# Altium project WMCB-V1_Project.PrjPCB
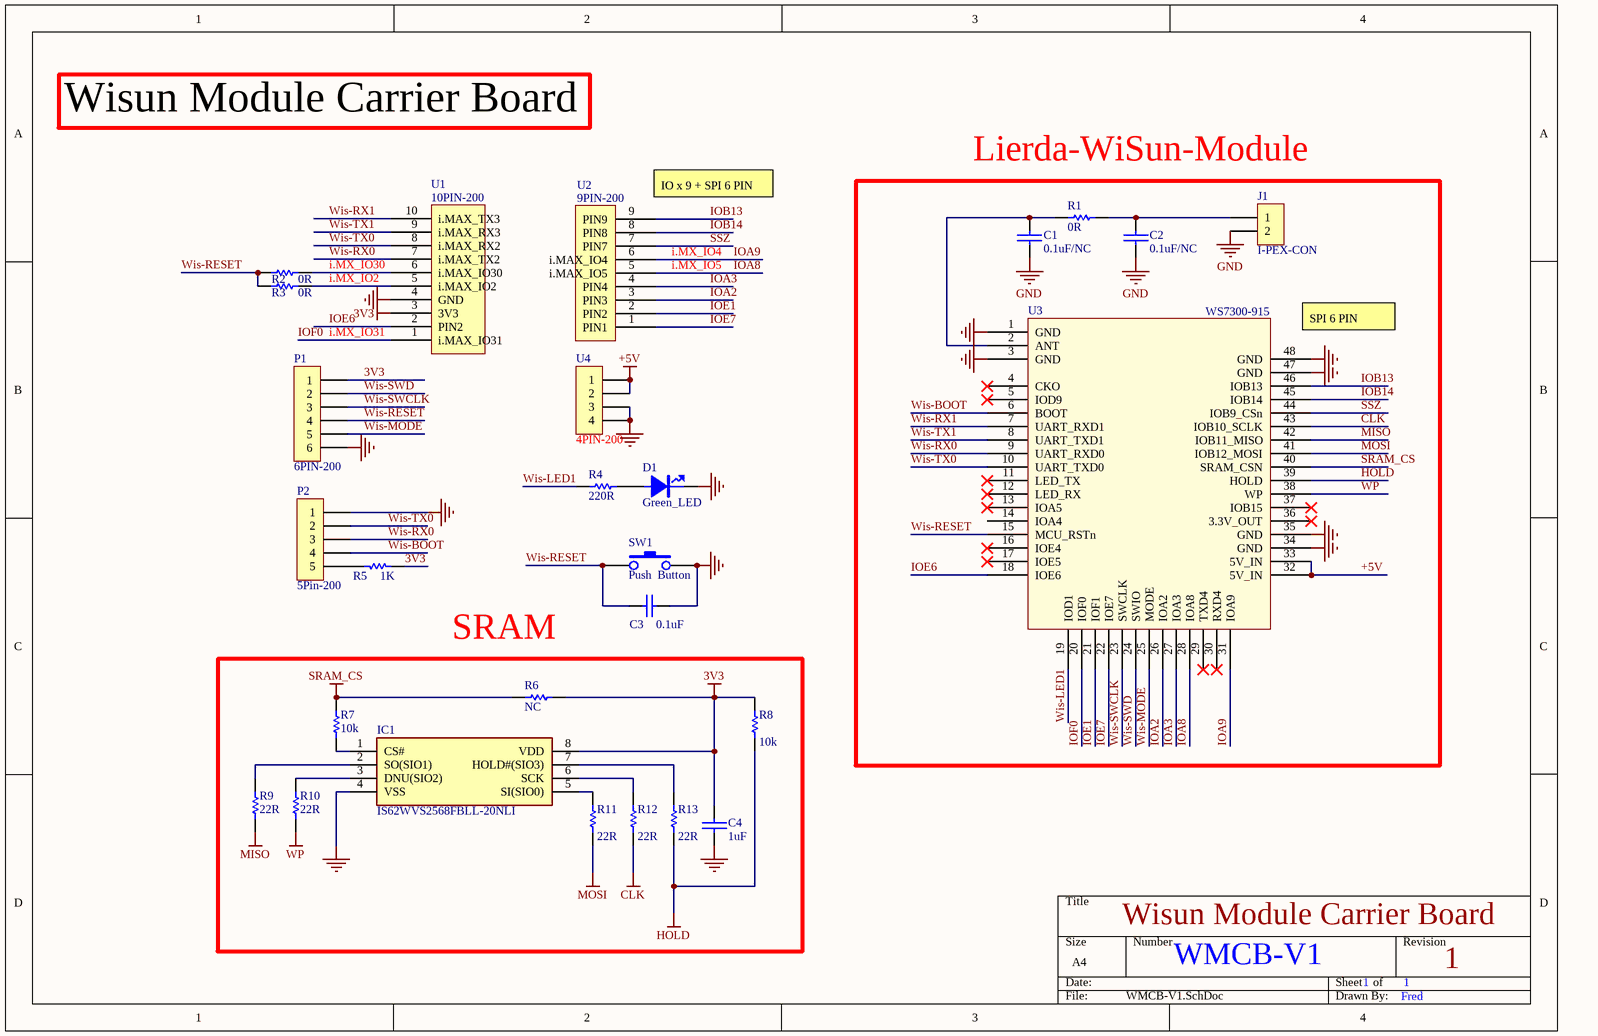
[diagram p0: WMCB-V1.SchDoc]
1 sheet, 27 parts. Net scope: global (net labels, ports and power ports of the same name join across sheets).
Board file: WMCB-V1.PcbDoc

## Sheet WMCB-V1.SchDoc
size A4

### Parts
C1  0.1uF/NC  [0402C]
C2  0.1uF/NC  [0402C]
C3  0.1uF  [0402C]
C4  1uF  [0402C]
D1  Green_LED  [LED0603--0.4mm]
IC1  IS62WVS2568FBLL-20NLI  [SOIC127P600X175-8N]
J1  I-PEX-CON  [I-PEX-CON]
P1  6PIN-200  [6PIN-200]
P2  5Pin-200  [5pin-200]
R1  0R  [0402]
R2  0R  [0402]
R3  0R  [0402]
R4  220R  [0402]
R5  1K  [0402]
R6  NC  [0402]
R7  10k  [0402]
R8  10k  [0402]
R9  22R  [0402]
R10  22R  [0402]
R11  22R  [0402]
R12  22R  [0402]
R13  22R  [0402]
SW1  Push  Button  [Button_2pin-3*4*2MM]
U1  10PIN-200  [10PIN-200]
U2  9PIN-200  [9PIN-200]
U3  WS7300-915  [WS7300-915]
U4  4PIN-200  [4PIN-200]

### Blocks framed on the sheet
Lierda-WiSun-Module: C1 C2 J1 R1 U3
SRAM: C4 IC1 R6-R13

### Nets
3V3: C4.2 IC1.8(VDD) P1.1 R5.1 R6.1 R8.2 U1.3(3V3)
+5V: U3.32(5V_IN) U3.33(5V_IN) U4.1 U4.2
CLK: R12.1 U3.43(IOB10_SCLK)
GND: C1.1 C2.1 C3.2 C4.1 D1.2 IC1.4(VSS) J1.2 P1.6 P2.1 SW1.2 U1.4(GND) U3.1(GND) U3.3(GND) U3.34(GND) U3.35(GND) U3.47(GND) U3.48(GND) U4.3 U4.4
HOLD: R8.1 R13.1 U3.39(HOLD)
MISO: R9.2 U3.42(IOB11_MISO)
MOSI: R11.1 U3.41(IOB12_MOSI)
SRAM_CS: R6.2 R7.1 U3.40(SRAM_CSN)
WP: R10.1 U3.38(WP)
i.MX_IO2: R3.1 U1.5(i.MAX_IO2)
i.MX_IO4: U2.6(i.MAX_IO4) U3.31(IOA9)  [also labelled IOA9]
i.MX_IO5: U2.5(i.MAX_IO5) U3.28(IOA8)  [also labelled IOA8]
i.MX_IO30: R2.1 U1.6(i.MAX_IO30)
i.MX_IO31: U1.1(i.MAX_IO31) U3.20(IOF0)  [also labelled IOF0]
IOA2: U2.3(PIN3) U3.26(IOA2)
IOA3: U2.4(PIN4) U3.27(IOA3)
IOB13: U2.9(PIN9) U3.46(IOB13)
IOB14: U2.8(PIN8) U3.45(IOB14)
IOE1: U2.2(PIN2) U3.21(IOF1)
IOE6: U1.2(PIN2) U3.18(IOE6)
IOE7: U2.1(PIN1) U3.22(IOE7)
SSZ: U2.7(PIN7) U3.44(IOB9_CSn)
Wis-BOOT: P2.4 U3.6(BOOT)
Wis-LED1: R4.2 U3.19(IOD1)
Wis-MODE: P1.5 U3.25(MODE)
Wis-RESET: C3.1 P1.4 R2.2 R3.2 SW1.1 U3.15(MCU_RSTn)
Wis-RX0: P2.3 U1.7(i.MAX_TX2) U3.9(UART_RXD0)
Wis-RX1: U1.10(i.MAX_TX3) U3.7(UART_RXD1)
Wis-SWCLK: P1.3 U3.23(SWCLK)
Wis-SWD: P1.2 U3.24(SWIO)
Wis-TX0: P2.2 U1.8(i.MAX_RX2) U3.10(UART_TXD0)
Wis-TX1: U1.9(i.MAX_RX3) U3.8(UART_TXD1)
NetC1_2: C1.2 R1.1 U3.2(ANT)
NetC2_2: C2.2 J1.1 R1.2
NetD1_1: D1.1 R4.1
NetIC1_1: IC1.1(CS#) R7.2
NetIC1_2: IC1.2(SO(SIO1)) R9.1
NetIC1_3: IC1.3(DNU(SIO2)) R10.2
NetIC1_5: IC1.5(SI(SIO0)) R11.2
NetIC1_6: IC1.6(SCK) R12.2
NetIC1_7: IC1.7(HOLD#(SIO3)) R13.2
NetP2_5: P2.5 R5.2

Not connected (* = marked no-connect by the designer): U3 4(CKO)* 5(IOD9)* 11(LED_TX)* 12(LED_RX)* 13(IOA5)* 14(IOA4) 16(IOE4)* 17(IOE5)* 29(TXD4)* 30(RXD4)* 36(3.3V_OUT)* 37(IOB15)*

### Notes on the sheet
- Wisun Module Carrier Board
- (near U2) IO x 9 + SPI 6 PIN
- (near U3) SPI 6 PIN
- WMCB-V1
- 1
- Fred

### Library data of the parts
C1 C2 C4 = CAP: Capacitor
  C4: Value: 1uF
C3 = Cap Semi: Capacitor (Semiconductor SIM Model); Published: 8-Jun-2000; LatestRevisionDate: 17-Jul-2002; LatestRevisionNote: Re-released for DXP Platform.; PackageReference: C1206; Publisher: Altium Limited; Value: 0.1uF
D1 = LED: Manufacturer's Part Number: CL-170G-CD-T; Part Number: 41100017000; Manufacturer: Citizen; Old Part Number: 4317000; Right: 40; Bottom: 20; VALUE_ALLEGRO: Red_LED; Package Height: 1.1mm; FPLIST: mot/0805LED,dig/0805led; PCB_x: 46.095000; PCB_y: 6.420000; PCB_dir: 90.000000; Cost: 0.48
IC1 = IS62WVS2568FBLL-20NLI: Integrated Circuit; Manufacturer_Name: Integrated Silicon Solution Inc.; Datasheet Link: https://componentsearchengine.com//IS62WVS2568FBLL-20NLI.pdf; Height: 1.75mm; Mouser2 Part Number: 870-WVS2568FBLL20NLI; Mouser2 Price/Stock: https://www.mouser.com/Search/Refine.aspx?Keyword=870-WVS2568FBLL20NLI; Manufacturer_Part_Number: IS62WVS2568FBLL-20NLI
J1 = CON2: Connector
P1 = 6PIN-200: Pin Header; LatestRevisionDate: 17-Jul-2002; LatestRevisionNote: Re-released for DXP Platform.; Publisher: Altium Limited
P2 = PIN5
R1-R13 = Res Semi: Semiconductor Resistor; Published: 8-Jun-2000; LatestRevisionDate: 17-Jul-2002; LatestRevisionNote: Re-released for DXP Platform.; PackageReference: AXIAL-0.5; Publisher: Altium Limited
  R1-R3: Value: 0R
  R4: Value: 220R
  R5: Value: 1K
  R6: Value: NC
  R7 R8: Value: 10k
  R9-R13: Value: 22R
SW1 = SW1: Push Button; Value: Switch-SMD-6x6mm
U4 = CON4: Connector; Value: MicroUSB